# Altium schematic sheet TEMPERATURE_MEASUREMENT.SchDoc
size D; SheetNumber: 2; SheetTotal: 7
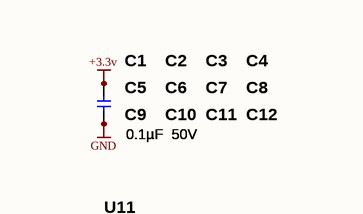
[diagram p0: TEMPERATURE_MEASUREMENT.SchDoc, top left]
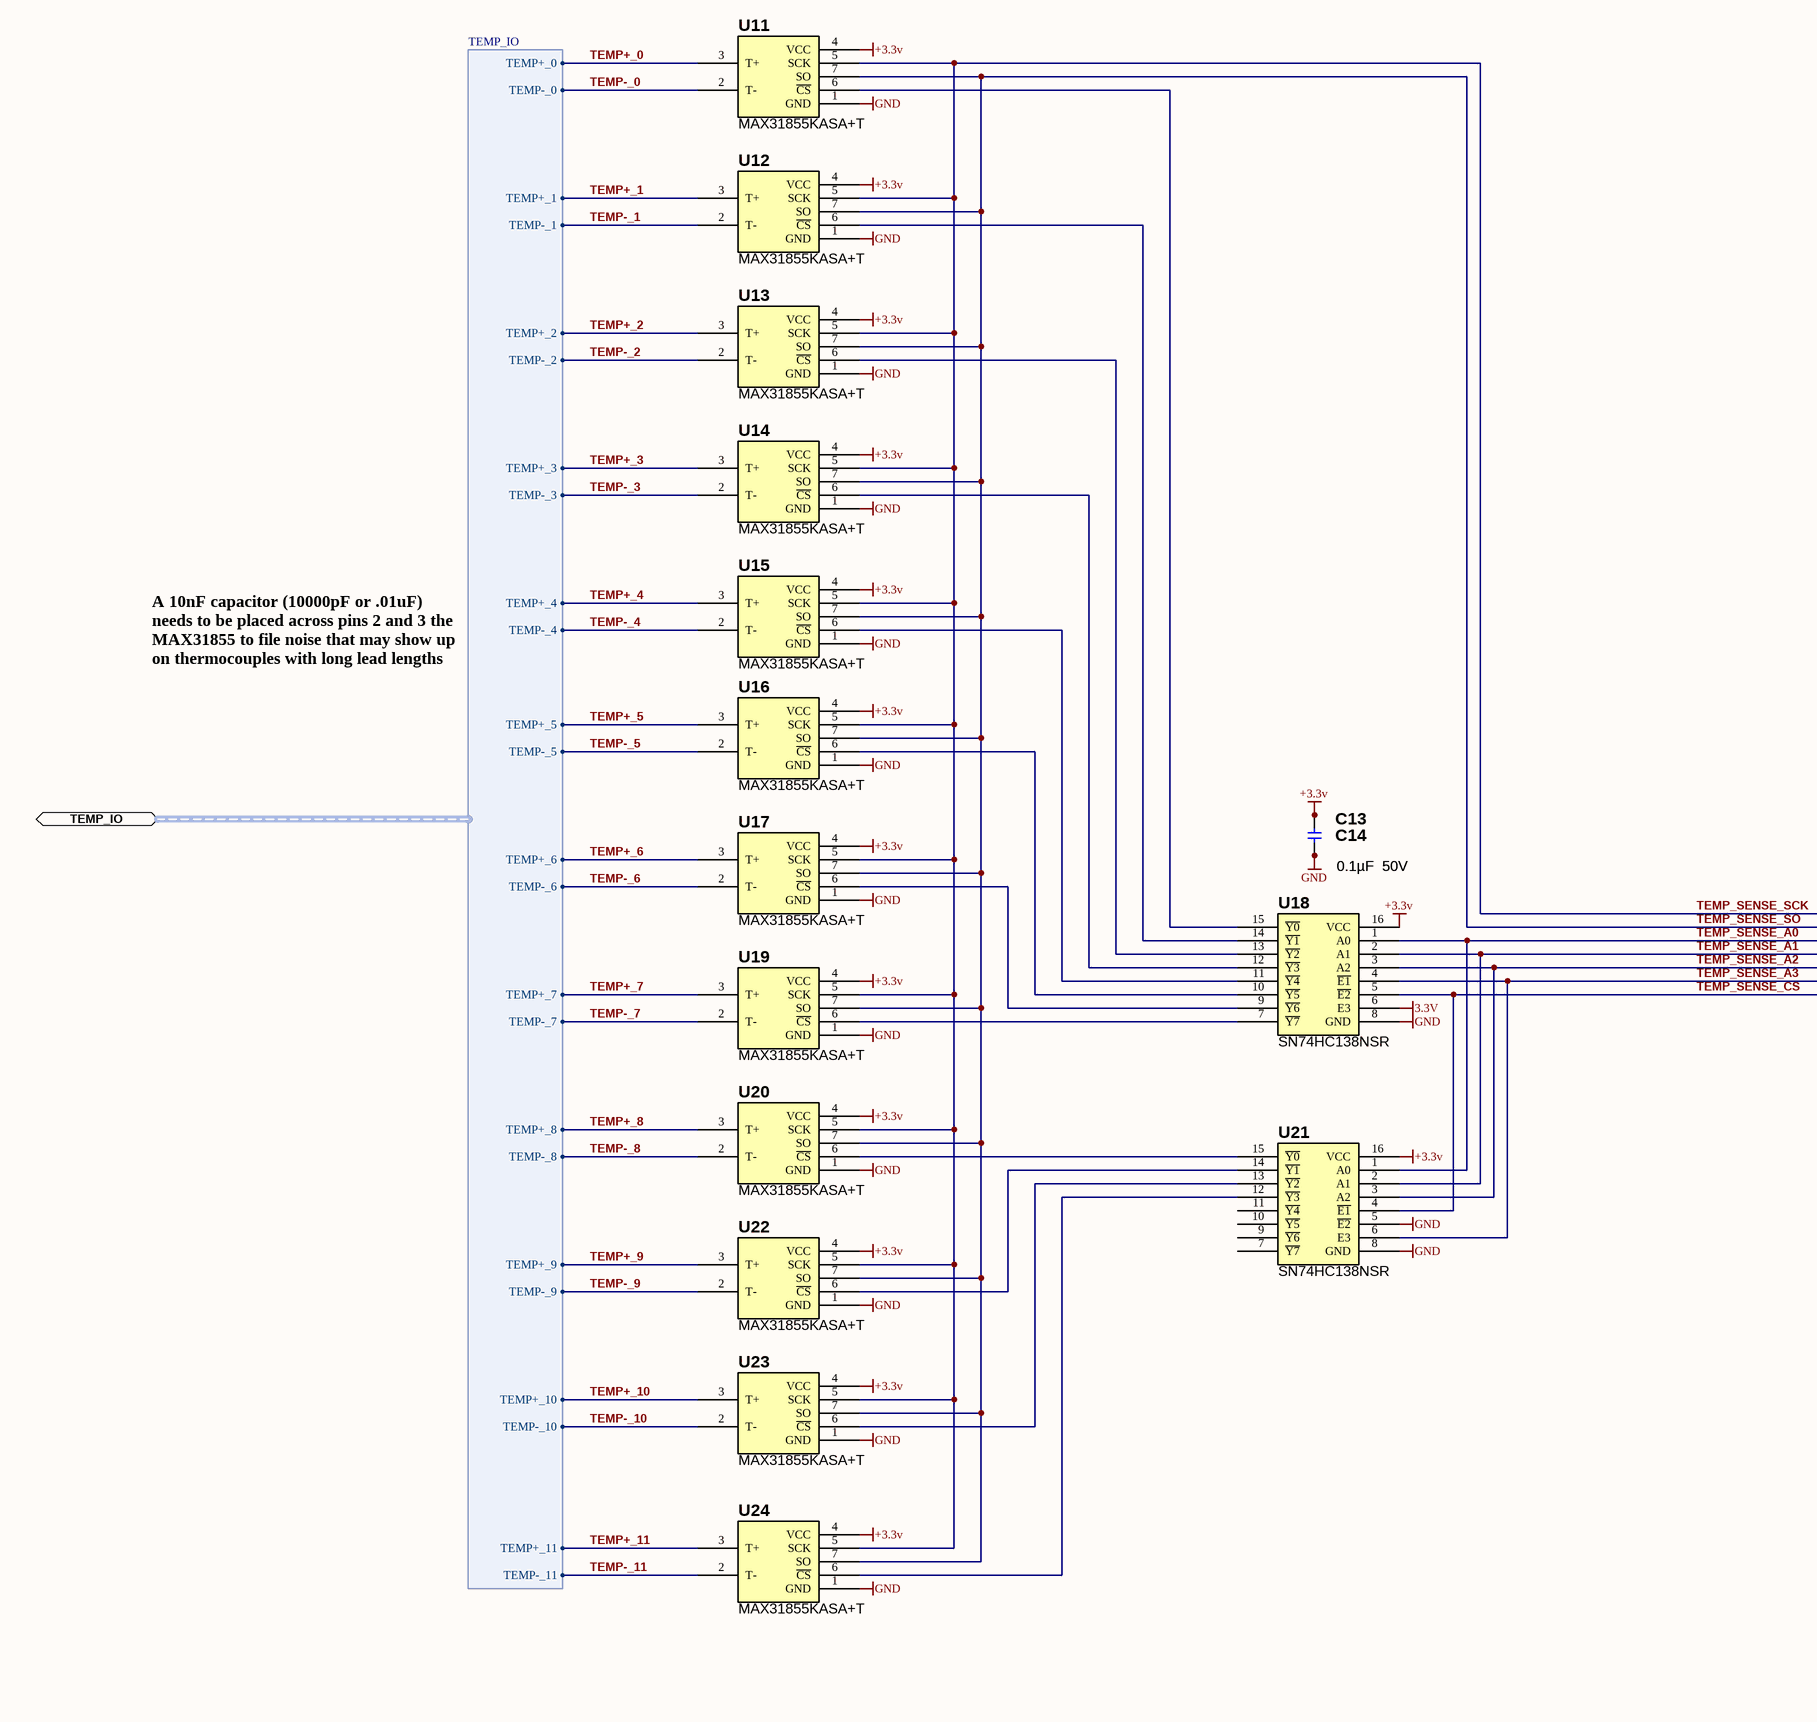
[diagram p1: TEMPERATURE_MEASUREMENT.SchDoc, bottom left]
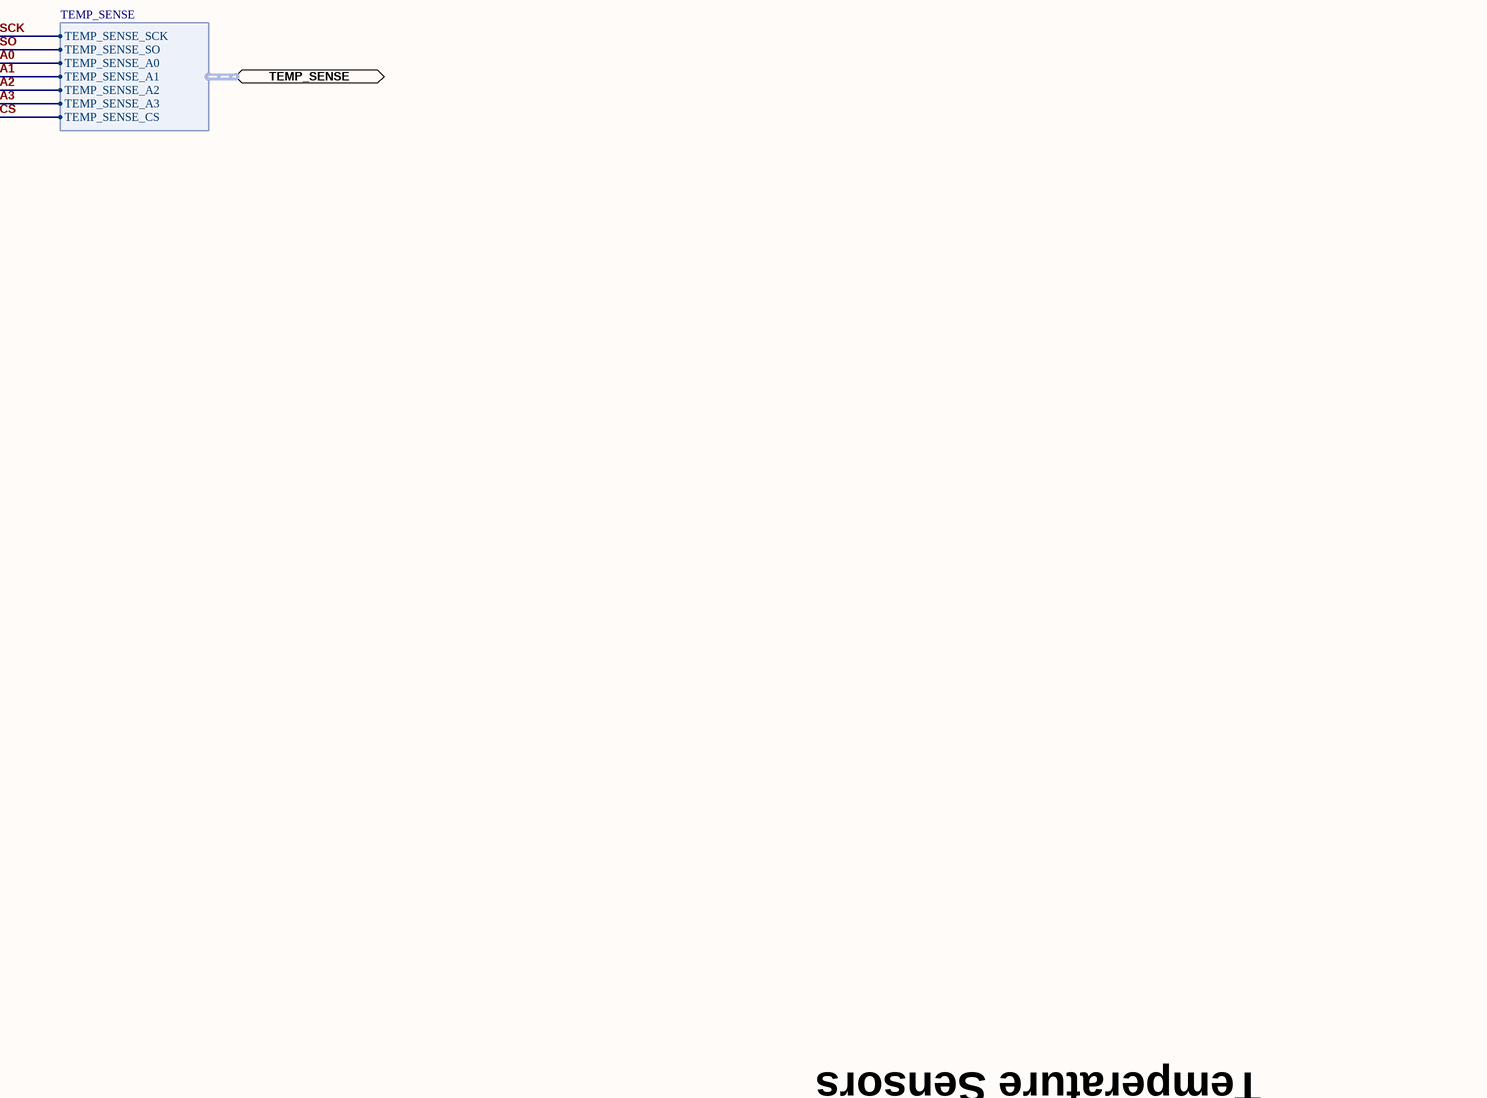
[diagram p2: TEMPERATURE_MEASUREMENT.SchDoc, bottom right]

## Parts
C1  0.1µF  50V  [C0805_LD]
C2  0.1µF  50V  [C0805_LD]
C3  0.1µF  50V  [C0805_LD]
C4  0.1µF  50V  [C0805_LD]
C5  0.1µF  50V  [C0805_LD]
C6  0.1µF  50V  [C0805_LD]
C7  0.1µF  50V  [C0805_LD]
C8  0.1µF  50V  [C0805_LD]
C9  0.1µF  50V  [C0805_LD]
C10  0.1µF  50V  [C0805_LD]
C11  0.1µF  50V  [C0805_LD]
C12  0.1µF  50V  [C0805_LD]
C13  0.1µF  50V  [C0805_LD]
C14  0.1µF  50V  [C0805_LD]
U11  MAX31855KASA+T  [SOIC 8]
U12  MAX31855KASA+T  [SOIC 8]
U13  MAX31855KASA+T  [SOIC 8]
U14  MAX31855KASA+T  [SOIC 8]
U15  MAX31855KASA+T  [SOIC 8]
U16  MAX31855KASA+T  [SOIC 8]
U17  MAX31855KASA+T  [SOIC 8]
U18  SN74HC138NSR  [SOIC 16 Wide]
U19  MAX31855KASA+T  [SOIC 8]
U20  MAX31855KASA+T  [SOIC 8]
U21  SN74HC138NSR  [SOIC 16 Wide]
U22  MAX31855KASA+T  [SOIC 8]
U23  MAX31855KASA+T  [SOIC 8]
U24  MAX31855KASA+T  [SOIC 8]

## Ports
TEMP_IO (harness TEMP_IO), TEMP_SENSE (harness TEMP_SENSE)

## Harnesses
TEMP_IO: TEMP-_0, TEMP+_0, TEMP+_1, TEMP-_1, TEMP+_2, TEMP-_2, TEMP+_3, TEMP-_3, TEMP+_4, TEMP-_4, TEMP+_5, TEMP-_5, TEMP+_6, TEMP-_6, TEMP+_7, TEMP-_7, TEMP+_8, TEMP-_8, TEMP+_9, TEMP-_9, TEMP+_10, TEMP-_10, TEMP+_11, TEMP-_11
TEMP_SENSE: TEMP_SENSE_SCK, TEMP_SENSE_SO, TEMP_SENSE_A0, TEMP_SENSE_A1, TEMP_SENSE_A2, TEMP_SENSE_A3, TEMP_SENSE_CS

## Nets
3.3V: U18.6(E3)
+3.3v: C1.2 C2.2 C3.2 C4.2 C5.2 C6.2 C7.2 C8.2 C9.2 C10.2 C11.2 C12.2 C13.2 C14.2 U11.4(VCC) U12.4(VCC) U13.4(VCC) U14.4(VCC) U15.4(VCC) U16.4(VCC) U17.4(VCC) U18.16(VCC) U19.4(VCC) U20.4(VCC) U21.16(VCC) U22.4(VCC) U23.4(VCC) U24.4(VCC)
GND: C1.1 C2.1 C3.1 C4.1 C5.1 C6.1 C7.1 C8.1 C9.1 C10.1 C11.1 C12.1 C13.1 C14.1 U11.1(GND) U12.1(GND) U13.1(GND) U14.1(GND) U15.1(GND) U16.1(GND) U17.1(GND) U18.8(GND) U19.1(GND) U20.1(GND) U21.5(~{E2}) U21.8(GND) U22.1(GND) U23.1(GND) U24.1(GND)
TEMP+_0: U11.3(T+) ; port TEMP_IO.TEMP+_0
TEMP+_1: U12.3(T+) ; port TEMP_IO.TEMP+_1
TEMP+_2: U13.3(T+) ; port TEMP_IO.TEMP+_2
TEMP+_3: U14.3(T+) ; port TEMP_IO.TEMP+_3
TEMP+_4: U15.3(T+) ; port TEMP_IO.TEMP+_4
TEMP+_5: U16.3(T+) ; port TEMP_IO.TEMP+_5
TEMP+_6: U17.3(T+) ; port TEMP_IO.TEMP+_6
TEMP+_7: U19.3(T+) ; port TEMP_IO.TEMP+_7
TEMP+_8: U20.3(T+) ; port TEMP_IO.TEMP+_8
TEMP+_9: U22.3(T+) ; port TEMP_IO.TEMP+_9
TEMP+_10: U23.3(T+) ; port TEMP_IO.TEMP+_10
TEMP+_11: U24.3(T+) ; port TEMP_IO.TEMP+_11
TEMP-_0: U11.2(T-) ; port TEMP_IO.TEMP-_0
TEMP-_1: U12.2(T-) ; port TEMP_IO.TEMP-_1
TEMP-_2: U13.2(T-) ; port TEMP_IO.TEMP-_2
TEMP-_3: U14.2(T-) ; port TEMP_IO.TEMP-_3
TEMP-_4: U15.2(T-) ; port TEMP_IO.TEMP-_4
TEMP-_5: U16.2(T-) ; port TEMP_IO.TEMP-_5
TEMP-_6: U17.2(T-) ; port TEMP_IO.TEMP-_6
TEMP-_7: U19.2(T-) ; port TEMP_IO.TEMP-_7
TEMP-_8: U20.2(T-) ; port TEMP_IO.TEMP-_8
TEMP-_9: U22.2(T-) ; port TEMP_IO.TEMP-_9
TEMP-_10: U23.2(T-) ; port TEMP_IO.TEMP-_10
TEMP-_11: U24.2(T-) ; port TEMP_IO.TEMP-_11
TEMP_SENSE_A0: U18.1(A0) U21.1(A0) ; port TEMP_SENSE.TEMP_SENSE_A0
TEMP_SENSE_A1: U18.2(A1) U21.2(A1) ; port TEMP_SENSE.TEMP_SENSE_A1
TEMP_SENSE_A2: U18.3(A2) U21.3(A2) ; port TEMP_SENSE.TEMP_SENSE_A2
TEMP_SENSE_A3: U18.4(~{E1}) U21.6(E3) ; port TEMP_SENSE.TEMP_SENSE_A3
TEMP_SENSE_CS: U18.5(~{E2}) U21.4(~{E1}) ; port TEMP_SENSE.TEMP_SENSE_CS
TEMP_SENSE_SCK: U11.5(SCK) U12.5(SCK) U13.5(SCK) U14.5(SCK) U15.5(SCK) U16.5(SCK) U17.5(SCK) U19.5(SCK) U20.5(SCK) U22.5(SCK) U23.5(SCK) U24.5(SCK) ; port TEMP_SENSE.TEMP_SENSE_SCK
TEMP_SENSE_SO: U11.7(SO) U12.7(SO) U13.7(SO) U14.7(SO) U15.7(SO) U16.7(SO) U17.7(SO) U19.7(SO) U20.7(SO) U22.7(SO) U23.7(SO) U24.7(SO) ; port TEMP_SENSE.TEMP_SENSE_SO
NetU11_6: U11.6(~{CS}) U18.15(~{Y0})
NetU12_6: U12.6(~{CS}) U18.14(~{Y1})
NetU13_6: U13.6(~{CS}) U18.13(~{Y2})
NetU14_6: U14.6(~{CS}) U18.12(~{Y3})
NetU15_6: U15.6(~{CS}) U18.11(~{Y4})
NetU16_6: U16.6(~{CS}) U18.10(~{Y5})
NetU17_6: U17.6(~{CS}) U18.9(~{Y6})
NetU18_7: U18.7(~{Y7}) U19.6(~{CS})
NetU20_6: U20.6(~{CS}) U21.15(~{Y0})
NetU21_12: U21.12(~{Y3}) U24.6(~{CS})
NetU21_13: U21.13(~{Y2}) U23.6(~{CS})
NetU21_14: U21.14(~{Y1}) U22.6(~{CS})

Not connected (* = marked no-connect by the designer): U21 7(~{Y7}) 9(~{Y6}) 10(~{Y5}) 11(~{Y4})

## Notes on the sheet
- A 10nF capacitor (10000pF or .01uF)  needs to be placed across pins 2 and 3 the MAX31855 to file noise that may show up on thermocouples with long lead lengths
- Temperature Sensors
- -1
- Wavenumber LLC
- 2pl
- Rev:
- Sheet
- of

## Library data of the parts
C1-C14 = GRM21BR71H104KA01L: CAP CER 0.1UF 50V 10% X7R 0805; Manufacturer: Murata Electronics North America; Value: 0.1µF  50V; Temperature Coefficient: X7R; Manufacturer Part Number: GRM21BR71H104KA01L; ComponentLink1Description: \\altium.sil.arl.psu.edu\Libraries\datasheets\Murata Electronics North America\c02e.pdf; ComponentLink1URL: http://search.murata.co.jp/Ceramy/image/img/A01X/G101/ENG/GRM1555C1HR60WA01-01.pdf; ComponentLink2Description: External Datasheet; ComponentLink2URL: http://www.murata.com/products/catalog/pdf/c02e.pdf; Stocked: 0; Supplier 1: Digi-Key; Supplier Part Number 1: 490-1666-1-ND; Category: Capacitors; Sort Value: 100000; Sort Value Package: 0805_100000; Pricing: 1 = 0.1  ;  10 = 0.046  ;  50 = 0.0248  ;  100 = 0.0209  ;  250 = 0.01712  ;  500 = 0.01464  ;  1000 = 0.0114 (USD); Sales Status: Active; Capacitance: 0.1µF; Voltage - Rated: 50V; Tolerance: ±10%; Mounting Type: Surface Mount- MLCC; Operating Temperature: -55°C ~ 125°C; Applications: General Purpose; Ratings: -; Package / Case: 0805 (2012 Metric); Size / Dimension: 0.079" L x 0.049" W (2.00mm x 1.25mm); Height - Seated (Max): -; Thickness (Max): 0.053" (1.35mm); Lead Spacing: -; Features: -; Packaging: Cut Tape (CT); Lead Style: -; Package: 0805; Thickness: 135
U11-U17 U19 U20 U22-U24 = MAX31855KASA+T: IC CONV THERMOCOUPLE-DGTL 8SOIC; Manufacturer: Maxim Integrated; Function: Thermocouple Cold Junction Compensator; Sensor Type: External; Sensing Temperature: -200°C ~ 1350°C; Accuracy: ±6°C(Max); Topology: ADC; Output Type: 3-Wire/SPI™ Serial; Output Alarm: No; Voltage - Supply: 3 V ~ 3.6 V; Supplier 1: Digi-Key; RoHS: RoHS Compliant; Category: Integrated Circuits (ICs); Stock 1: 2436; Pricing 1: 1=7.38, 25=5.5692, 100=4.8731, 500=4.45536 (USD); Packaging: Cut Tape (CT); Output Fan: No; Operating Temperature: -40°C ~ 125°C; Mounting Type: Surface Mount; Package / Case: 8-SOIC (0.154", 3.90mm Width); Supplier Device Package: 8-SOIC N; ComponentLink1URL: http://datasheets.maximintegrated.com/en/ds/MAX31855.pdf; ComponentLink1Description: http://datasheets.maximintegrated.com/en/ds/MAX31855.pdf; Supplier Part Number 1: MAX31855KASA+TCT-ND; Value: MAX31855KASA+T; Manufacturer Part Number: MAX31855KASA+T
U18 U21 = SN74HC138NSR: IC DECODER/DEMUX 3-8 LINE 16SO; Manufacturer: Texas Instruments; Circuit: 1 x 3:8; Independent Circuits: 1; Current - Output High, Low: 5.2mA, 5.2mA; Voltage Supply Source: Single Supply; Voltage - Supply: 2 V ~ 6 V; Supplier 1: Digi-Key; RoHS: RoHS Compliant; Category: Integrated Circuits (ICs); Stock 1: 3936; Pricing 1: 1=0.44, 10=0.371, 25=0.3248, 100=0.2781, 250=0.2412, 500=0.2043, 1000=0.1575 (USD); Packaging: Cut Tape (CT); Type: Decoder/Demultiplexer; Operating Temperature: -40°C ~ 85°C; Mounting Type: Surface Mount; Package / Case: 16-SOIC (0.209", 5.30mm Width); Supplier Device Package: 16-SO; ComponentLink1URL: http://www.ti.com/lit/ds/symlink/sn74hc138.pdf; ComponentLink1Description: http://www.ti.com/lit/ds/symlink/sn74hc138.pdf; Supplier Part Number 1: 296-12886-1-ND; Manufacturer Part Number: SN74HC138NSR; Value: SN74HC138NSR